# EAGLE design panda_interface_point (EAGLE 9.2.2)
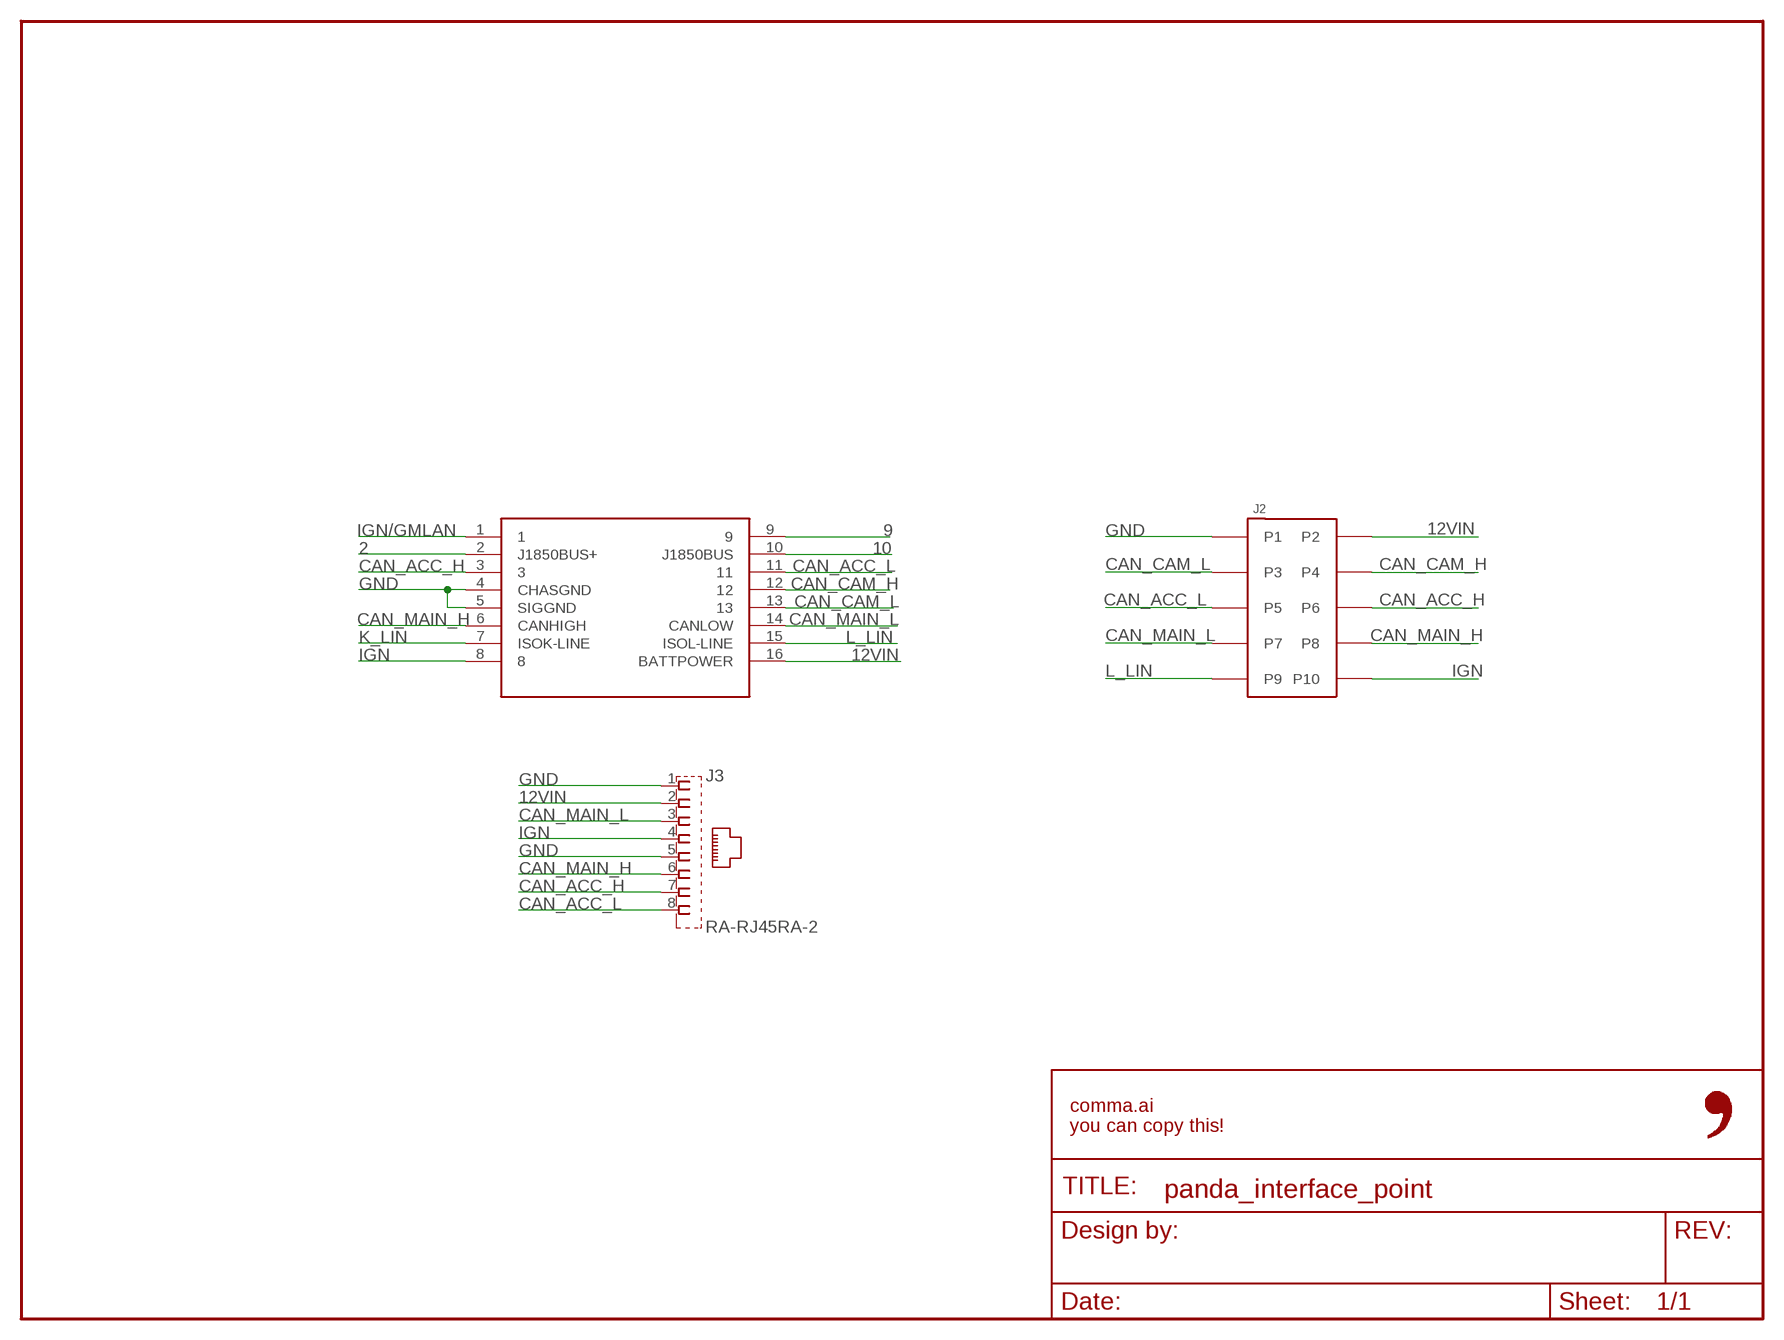
[diagram p0: schematic, sheet 1]

## Parts
FRAME1  FRAME-LETTER-OPENNO_PACKAGE  [DUMMY]
J1  OBDII-FEMALE-CUT  [OBDII-FEMALE-MIDCUT]
J2  5018761040  [5018761040]
J3  RA-RJ45RA-2  [RA-RJ45-2]

## Nets
2: J1.2(J1850BUS+)
9: J1.9
10: J1.10(J1850BUS)
12VIN: J1.16(BATTPOWER) J2.P2 J3.2
CAN_ACC_H: J1.3 J2.P6 J3.7
CAN_ACC_L: J1.11 J2.P5 J3.8
CAN_CAM_H: J1.12 J2.P4
CAN_CAM_L: J1.13 J2.P3
CAN_MAIN_H: J1.6(CANHIGH) J2.P8 J3.6
CAN_MAIN_L: J1.14(CANLOW) J2.P7 J3.3
GND: J1.4(CHASGND) J1.5(SIGGND) J2.P1 J3.1 J3.5
IGN: J1.8 J2.P10 J3.4
IGN/GMLAN: J1.1
K_LIN: J1.7(ISOK-LINE)
L_LIN: J1.15(ISOL-LINE) J2.P9

## Library data of the parts
FRAME1 = comma.ai:FRAME-LETTER-OPEN: Schematic Frame - Letter Standard 8.5x11 US Letter frame; DESIGNER: Nobody; VERSION: v01
J1 = comma.ai:OBDII-FEMALE
J2 = 5018761440:5018761040
J3 = comma.ai:RA-RJ45

## Board
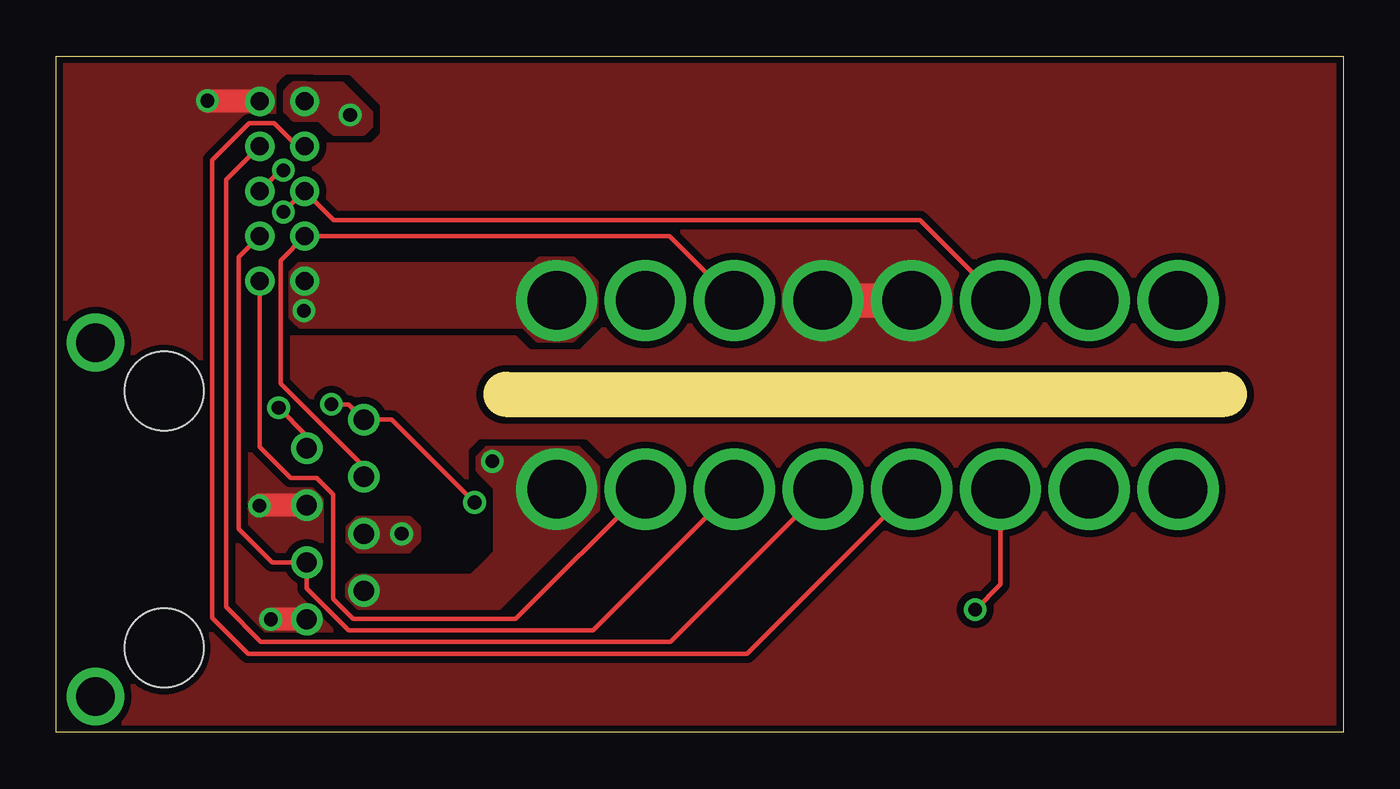
[diagram p1: board, top side]
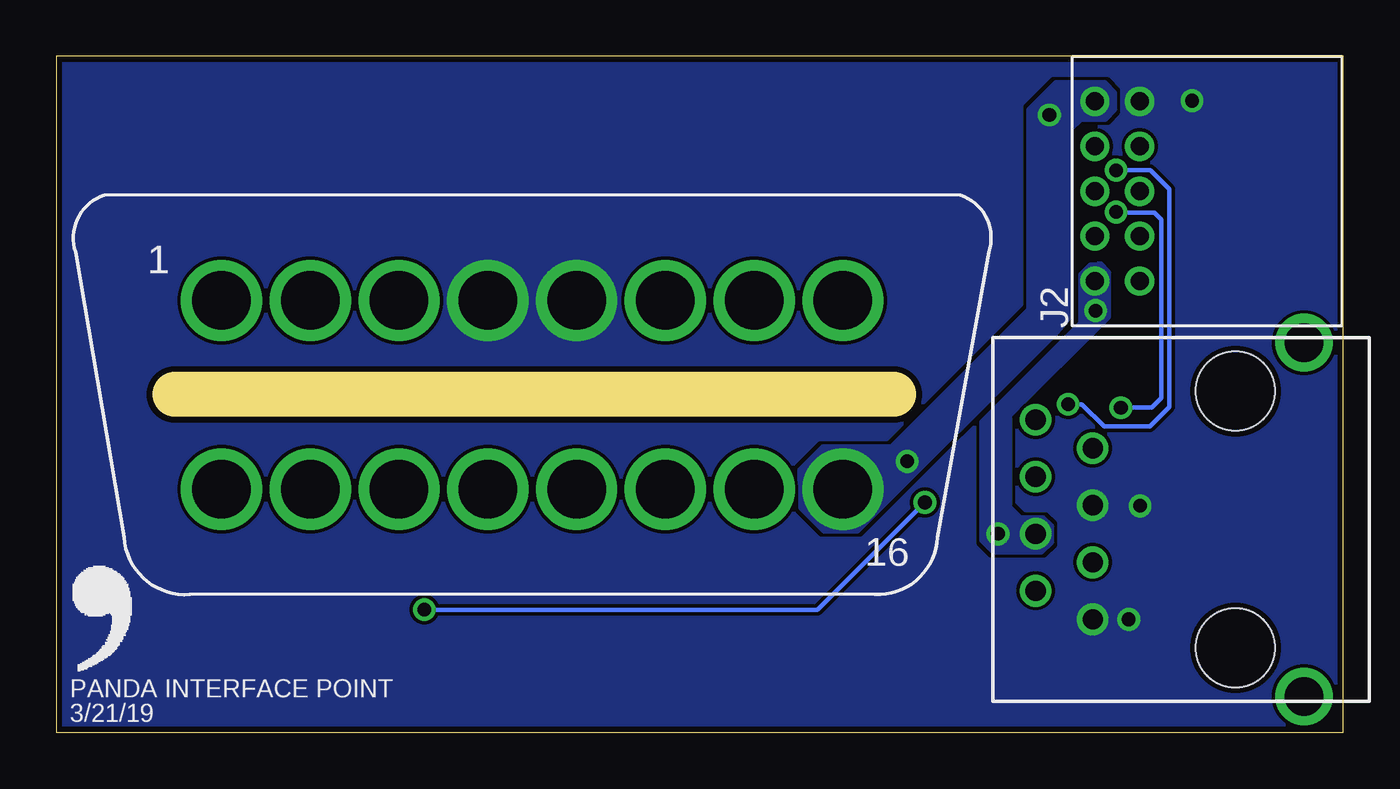
[diagram p2: board, bottom side, seen from below]

Size 57.28 x 30.1 mm. Coordinates in mm from the lower left corner, seen from the top.
Outline: 20,15.05 52,15.05
Outline: 57.28,0 0,0 0,30.1 57.28,30.1 57.28,0
Copper layers (1*16): Top 0.035mm / dielectric 1.5mm / Bottom 0.035mm
Design rules "default *": minimum track width 6mil, minimum drill 24mil, track to track 6mil, track to pad 6mil, pad to pad 6mil, via to via 6mil, smd to smd 6mil, copper to edge 10mil, drill to drill 8mil, minimum pad ring 10mil, minimum via ring 8mil, stop-mask expansion 4mil, vias tented up to drill 0mil, thermal gap 10mil

### Footprints (pad centres in the part's own frame; a part is rotated, then mirrored left to right if it is on the bottom)
OBDII-FEMALE-MIDCUT = drill 2.6 pad 3.4: 1 13.825,-4.2; 2 9.875,-4.2; 3 5.925,-4.2; 4 1.975,-4.2; 5 -1.975,-4.2; 6 -5.925,-4.2; 7 -9.875,-4.2; 8 -13.825,-4.2; 9 13.825,4.2; 10 9.875,4.2; 11 5.925,4.2; 12 1.975,4.2; 13 -1.975,4.2; 14 -5.925,4.2; 15 -9.875,4.2; 16 -13.825,4.2
5018761040 = drill 0.8: P1 5,-1; P2 5,1; P3 3,-1; P4 3,1; P5 1,-1; P6 1,1; P7 -1,-1; P8 -1,1; P9 -3,-1; P10 -3,1
RA-RJ45-2 = drill 0.9: 1 4.445,-1.905; 2 3.175,-4.445; 3 1.905,-1.905; 4 0.635,-4.445; 5 -0.635,-1.905; 6 -1.905,-4.445; 7 -3.175,-1.905; 8 -4.445,-4.445 | drill 1.71: P$1 -7.875,7.495; P$2 7.875,7.495 | hole 3.51: -5.715,4.445; 5.715,4.445

### Placement (x,y rotation side)
FRAME1  0,-1.27 0 top
J1  36.09,15.02 180 bottom
J2  10.06,23.09 90 bottom
J3  9.25,9.47 270 bottom
U$1  [LOGO]  57.2,2.41 0 bottom

### Tracks (layer width: path | path; a pad name or v marks a point on that pad's centre or on a via)
12VIN  (via drill 0.61)
  other vias: 13.08,27.48 19.41,12.06
  pour Top (no thermals): 11.13,28.88 12.73,28.88 13.84,27.76 14.02,27.58 14.02,26.97 13.69,26.64 13.59,26.64 12.34,26.64 12.24,26.75 11.71,27.28 11.13,27.28 10.57,27.28 10.31,27.53 10.19,27.66 10.19,28.27 10.19,28.52 10.41,28.75 10.57,28.91 11.1,28.91
  pour Top (no thermals): 13.59,5.54 19.71,5.54 23.85,9.68 24.1,9.93 24.1,10.95 24.1,11.79 23.42,12.47 23.24,12.65 21.56,12.65 19.15,12.65 19.13,12.62 18.75,12.24 18.75,11.68 18.82,11.61 18.82,11.58 19.53,10.87 19.53,8 19.1,7.57 18.49,6.96 13.79,6.96 13.36,6.96 13.03,6.63 12.95,6.55 12.95,6.05 13.46,5.54 13.54,5.54
  pour Bottom (no thermals): 24.16,10.97 24.16,9.98 23.11,8.94 21.62,8.94 12.73,17.83 12.3,18.33 12.14,18.49 12.14,26.82 11.68,27.28 10.59,27.28 10.16,27.71 10.16,28.47 10.62,28.93 12.8,28.93 14.02,27.71 14.02,18.82 20.12,12.73 23.16,12.73 24.21,11.68 24.21,10.69
CAN_ACC_H  (via drill 0.61)
  Top 0.203: J1.3 38.43,22.81 12.34,22.81 J2.P6 11.03,24.09 v10.11,23.16 | J3.7 11.15,13.2 v9.9,14.45
  Bottom 0.203: v9.9,14.45 8.53,14.45 8.1,14.88 8.1,22.83 8.41,23.14 10.08,23.14 v10.11,23.16
CAN_ACC_L  (via drill 0.61)
  Top 0.203: J1.11 42.02,6.58 v40.89,5.46 | v18.62,10.24 14.94,13.92 J3.8 13.01,14.61 v12.24,14.61 | J2.P5 9.99,25.02 v10.11,25.02
  Bottom 0.203: v40.89,5.46 23.39,5.46 v18.62,10.24 | v12.24,14.61 11.63,14.61 10.64,13.61 8.61,13.61 7.74,14.48 7.74,24.18 8.59,25.02 v10.11,25.02
CAN_CAM_H
  Top 0.203: J1.12 30.75,3.5 8.53,3.5 6.93,5.11 6.93,25.48 8.58,27.12 9.69,27.12 10.72,26.09 J2.P4
CAN_CAM_L
  Top 0.203: J2.P3 7.57,24.6 7.57,5.58 9.11,4.04 27.33,4.04 J1.13
CAN_MAIN_H
  Top 0.203: J1.6 27.3,22.09 J2.P8 9.98,21.01 9.98,15.54 13.69,11.83 J3.6
CAN_MAIN_L
  Top 0.203: J1.14 23.89,4.55 13.01,4.55 11.15,6.4 J3.3 9.62,7.57 8.13,9.06 8.13,21.16 J2.P7
GND  (via drill 0.61)
  Top 1.016: J3.1 v9.55,5.03 | J3.5 9.07,10.11 v9.04,10.08 | J2.P1 6.76,28.09 v6.73,28.12
  Top 1.524: J1.5 J1.4
  pour Top (isolate 0.305, rank 2, no thermals): -0.69,30.3 -0.69,-0.15 57.66,-0.15 57.66,30.3
  pour Bottom (rank 2, no thermals): -0.69,30.33 -0.69,-0.18 57.45,-0.18 57.63,0 57.63,30.33
IGN  (via drill 0.61)
  other vias: 11.02,18.77 15.37,8.84
  pour Top (no thermals): 12.98,8.84 12.98,9.12 13.23,9.37 13.41,9.55 14.17,9.55 15.72,9.55 15.77,9.5 16.15,9.12 16.15,8.66 16.15,8.53 15.8,8.18 15.67,8.05 13.67,8.05 13.44,8.05 13.03,8.46 12.98,8.51
  pour Bottom (no thermals): 10.92,20.83 11.25,20.83 11.71,20.37 11.71,18.21 16.1,13.82 16.1,8.53 15.57,8 13.44,8 12.98,8.46 12.98,9.19 13.36,9.58 14.33,9.58 14.35,9.55 14.83,10.03 14.83,14.1 10.44,18.49 10.44,20.5 10.82,20.88 10.87,20.88
  pour Top (no thermals): 11.07,20.85 21.29,20.85 21.34,20.9 21.51,21.08 22.76,21.08 23.01,21.08 23.83,20.27 24.05,20.04 24.05,18.95 24.05,18.52 23.55,18.01 22.99,17.45 22.5,17.45 21.89,17.45 21.41,17.45 20.8,18.06 10.85,18.06 10.57,18.34 10.44,18.47 10.44,18.77 10.44,20.47 10.46,20.5 10.82,20.85
L_LIN
  Top 0.203: J2.P9 9.06,12.71 10.44,11.33 11.59,11.33 12.32,10.6 12.32,5.94 13.2,5.05 20.45,5.05 J1.15

### Text on the board
bPlace: PANDA INTERFACE POINT | 3/21/19